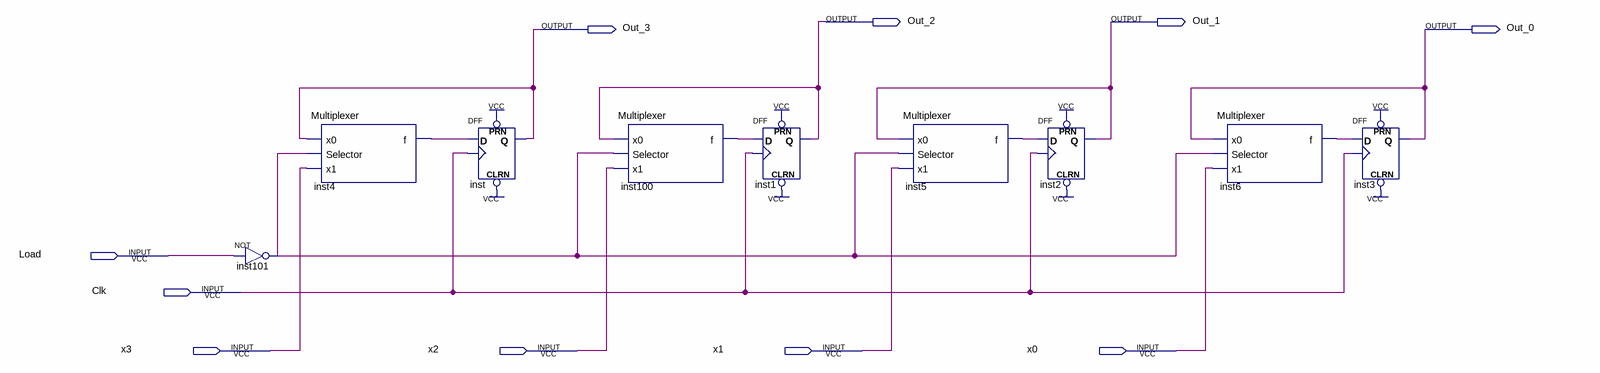
[diagram p0: schematic sheet]
// Quartus schematic Register.bdf as structural Verilog: 9 symbols, 10 pins
module Register (
  input  Load,
  input  Clk,
  input  x3,
  input  x2,
  input  x1,
  input  x0,
  output Out_2,
  output Out_1,
  output Out_3,
  output Out_0
);

  wire inst4_f, inst5_f, inst6_f, inst100_f, inst101_out;

  not inst101 (inst101_out, Load);
  Multiplexer inst4 (.x0(Out_3), .Selector(inst101_out), .x1(x3), .f(inst4_f));
  DFF inst (.CLRN(1'b1), .CLK(Clk), .D(inst4_f), .PRN(1'b1), .Q(Out_3));
  Multiplexer inst100 (.x0(Out_2), .Selector(inst101_out), .x1(x2), .f(inst100_f));
  DFF inst1 (.CLRN(1'b1), .CLK(Clk), .D(inst100_f), .PRN(1'b1), .Q(Out_2));
  Multiplexer inst5 (.x0(Out_1), .Selector(inst101_out), .x1(x1), .f(inst5_f));
  DFF inst2 (.CLRN(1'b1), .CLK(Clk), .D(inst5_f), .PRN(1'b1), .Q(Out_1));
  Multiplexer inst6 (.x0(Out_0), .Selector(inst101_out), .x1(x0), .f(inst6_f));
  DFF inst3 (.CLRN(1'b1), .CLK(Clk), .D(inst6_f), .PRN(1'b1), .Q(Out_0));
endmodule
